# Altium schematic sheet 9_arduinoConnectors.SchDoc
size A4
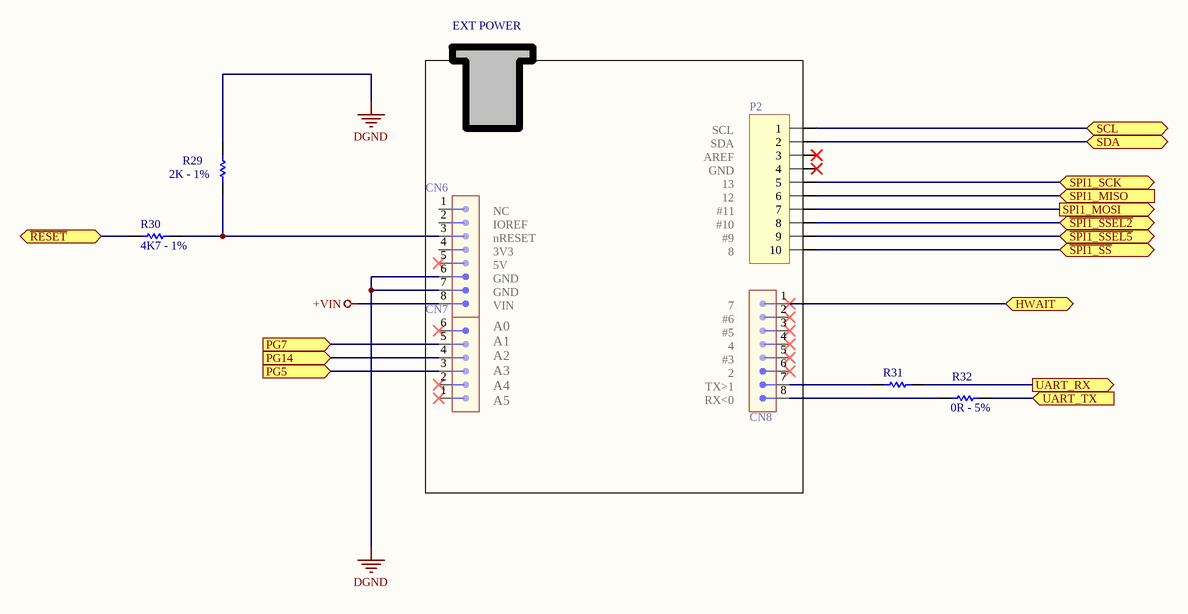
[diagram p0: 9_arduinoConnectors.SchDoc]

## Parts
CN6  Conector M HEADER, 180G, SIMPLES, 8P  [BLKCON.100/MCS-8/W.100/8]  (value not drawn)
CN7  Conector M HEADER, 180G, SIMPLES, 6P  [BLKCON.100/MCS-6/W.100/6]  (value not drawn)
CN8  Conector M HEADER, 180G, SIMPLES, 8P  [BLKCON.100/MCS-8/W.100/8]  (value not drawn)
P2  Header 10  [HDR1X10]  (value not drawn)
R29  VALOR: 2K - 1%  [SMD0805]  (hidden comment: 2K - 1% - 0805 - 392)
R30  VALOR: 4K7 - 1%  [SMD0805]  (hidden comment: 4K7 - 1% - 0805 - 438)
R31  0R - 5% - 0805 - 3365  [SMD0805]  (value not drawn)
R32  VALOR: 0R - 5%  [SMD0805]  (hidden comment: 0R - 5% - 0805 - 3365)

## Ports
HWAIT (bidir), PG5 (in), PG7 (in), PG14 (in), SCL (bidir), SDA (bidir), SPI1_MISO (in), SPI1_MOSI (out), SPI1_SCK (bidir), UART_RX (out), UART_TX (in), ~{RESET} (bidir), ~{SPI1_SSEL2} (bidir), ~{SPI1_SSEL5} (bidir), ~{SPI1_SS} (bidir)

## Nets
+VIN: CN6.8
DGND: CN6.6 CN6.7 R29.2
~{RESET}: R30.1 ; port ~{RESET}
~{SPI1_SS}: P2.10 ; port ~{SPI1_SS}
~{SPI1_SSEL2}: P2.8 ; port ~{SPI1_SSEL2}
~{SPI1_SSEL5}: P2.9 ; port ~{SPI1_SSEL5}
HWAIT: CN8.1 ; port HWAIT
PG5: CN7.3 ; port PG5
PG7: CN7.5 ; port PG7
PG14: CN7.4 ; port PG14
SCL: P2.1 ; port SCL
SDA: P2.2 ; port SDA
SPI1_MISO: P2.6 ; port SPI1_MISO
SPI1_MOSI: P2.7 ; port SPI1_MOSI
SPI1_SCK: P2.5 ; port SPI1_SCK
UART_RX: R31.2 ; port UART_RX
UART_TX: R32.2 ; port UART_TX
NetCN6_3: CN6.3 R29.1 R30.2
NetCN8_7: CN8.7 R31.1
NetCN8_8: CN8.8 R32.1

Not connected (* = marked no-connect by the designer): CN6 1 2 4 5*; CN7 1* 2* 6*; CN8 2* 3* 4* 5* 6*; P2 3* 4*

## Notes on the sheet
- EXT POWER
- SCL
  SDA
  AREF
  GND
  13
  12
  #11
  #10
  #9
  8
- NC
  IOREF
  nRESET
  3V3
  5V
  GND
  GND
  VIN
- A0
  A1
  A2
  A3
  A4
  A5
- (near CN8) 7
  #6
  #5
  4
  #3
  2
  TX>1
  RX<0

## Library data of the parts
CN6 CN8 = CNC M HEADER, 180G, SIMPLES, 8P - 786: MANUFACTURER: METALTEX; PARTNUMBER: MCS-08; CODIGO: 786; DESC: CNC PCI, MINI HEADER SIMPLES, 8P, 180G, 2.54MM; VALOR: Conector M HEADER, 180G, SIMPLES, 8P; LOCALIZAÇÃO: *; FORNECEDOR: METALTEX; FACTORY PACK: *; ENCAPSULAMENTO: *; EMBALAGEM: *; ComponentLink2URL: www.metaltex.com.br; ComponentLink2Description: HOME METALTEX; ComponentLink1URL: *; ComponentLinK1Description: Datasheet; NCM: 8536.90.40
CN7 = CNC M HEADER, 180G, SIMPLES, 6P - 785: MANUFACTURER: METALTEX; PARTNUMBER: MCS-06; DESC: CNC PCI, MINI HEADER SIMPLES, 6P, 180G, 2.54MM; CODIGO: 785; VALOR: Conector M HEADER, 180G, SIMPLES, 6P; ComponentLinK1Description: Datasheet; ComponentLink1URL: *; ComponentLink2Description: HOME METALTEX; ComponentLink2URL: www.metaltex.com.br; EMBALAGEM: *; ENCAPSULAMENTO: *; FACTORY PACK: *; LOCALIZAÇÃO: *; FORNECEDOR: METALTEX; NCM: 8536.90.40
P2 = Header 10: Header, 10-Pin; LatestRevisionDate: 17-Jul-2002; LatestRevisionNote: Re-released for DXP Platform.; Publisher: Altium Limited
R29 = 2K - 1% - 0805 - 392: Resistor 2K, 1%, SMD 0805; PARTNUMBER: 0805W8F2001T5E; MANUFACTURER: SAMSUNG; CODIGO: 392; EMBALAGEM: REEL; FORNECEDOR: VARIOS; DESC: RES 2K, 1%, SMD 0805, MF; TARGET MÁX U$: $0.0015; LOCALIZAÇÃO: *; ENCAPSULAMENTO: SMD0805; FACTORY PACK: 5000; Supplier 1: AVNET; Supplier Part Number 1: 0805W8F2001T5E; ComponentLink1Description: Datasheet; ComponentLink1URL: http://download.siliconexpert.com/pdfs/2011/2/28/4/59/40/979/sam_/manual/resistor-general1.pdf; ComponentLink2Description: HOME SANSUNG; ComponentLink2URL: http://www.samsung.com/global/business/semiconductor/; NCM: 8533.21.20
R30 = 4K7 - 1% - 0805 - 438: Resistor 4K7, 1%, SMD 0805; PARTNUMBER: RC2012F4701CS; MANUFACTURER: SAMSUNG; CODIGO: 438; EMBALAGEM: REEL; FORNECEDOR: VARIOS; DESC: RES 4K7, 1%, SMD 0805, MF; TARGET MÁX U$: $0.0015; LOCALIZAÇÃO: *; ENCAPSULAMENTO: SMD0805; FACTORY PACK: 5000; ComponentLink1Description: Datasheet; ComponentLink1URL: http://avnetexpress.avnet.com/store/em/EMController/_/A-5002847207733/An-0?action=part&catalogId=500201&langId=-1&storeId=500201&CMP=KNC-SupplyFrame_VSE-T11; ComponentLink2Description: HOME SAMSUNG; ComponentLink2URL: http://www.samsung.com/global/business/semiconductor/; Supplier 1: AVNET; Supplier Part Number 1: RC2012F4701CS; NCM: 8533.21.20
R31 = 0R - 5% - 0805 - 3365: Resistor 0R, 5%, SMD 0805; PARTNUMBER: ERJ-6GEY0R00V; MANUFACTURER: PANASONIC; CODIGO: 3365; EMBALAGEM: REEL; FORNECEDOR: VARIOS; DESC: RES 0R, 5%, SMD 0805, MF; TARGET MÁX U$: $0.0012; VALOR: 0R - 5%; LOCALIZAÇÃO: *; ENCAPSULAMENTO: SMD0805; FACTORY PACK: 5.000; ComponentLink1Description: Datasheet; ComponentLink1URL: http://www.mouser.com/ds/2/315/AOA0000CE1-37422.pdf; ComponentLink2Description: HOME PANASONIC; ComponentLink2URL: http://www.panasonic.com/industrial/electronic-components/; Supplier 1: Mouser; Supplier Part Number 1: 667-ERJ-6GEY0R00V; NCM: 8533.21.20
R32 = 0R - 5% - 0805 - 3365: Resistor 0R, 5%, SMD 0805; PARTNUMBER: ERJ-6GEY0R00V; MANUFACTURER: PANASONIC; CODIGO: 3365; EMBALAGEM: REEL; FORNECEDOR: VARIOS; DESC: RES 0R, 5%, SMD 0805, MF; TARGET MÁX U$: $0.0012; LOCALIZAÇÃO: *; ENCAPSULAMENTO: SMD0805; FACTORY PACK: 5.000; ComponentLink1Description: Datasheet; ComponentLink1URL: http://www.mouser.com/ds/2/315/AOA0000CE1-37422.pdf; ComponentLink2Description: HOME PANASONIC; ComponentLink2URL: http://www.panasonic.com/industrial/electronic-components/; Supplier 1: Mouser; Supplier Part Number 1: 667-ERJ-6GEY0R00V; NCM: 8533.21.20